# EasyEDA Pro project ProDoc_TP_V2.10_BG.epro

# Schematic Schematic_210_BG

## Sheets
1 MCU: Board Name: TP_V2.8_BG_1; Create Date: 2024-10-07; Page Name: MCU; Project Name: gavvv; Schematic Name: Schematic_28_BG_1; Update Date: 2024-10-07; Company: 嘉立创EDA; Page Size: A4; Version: V1.0
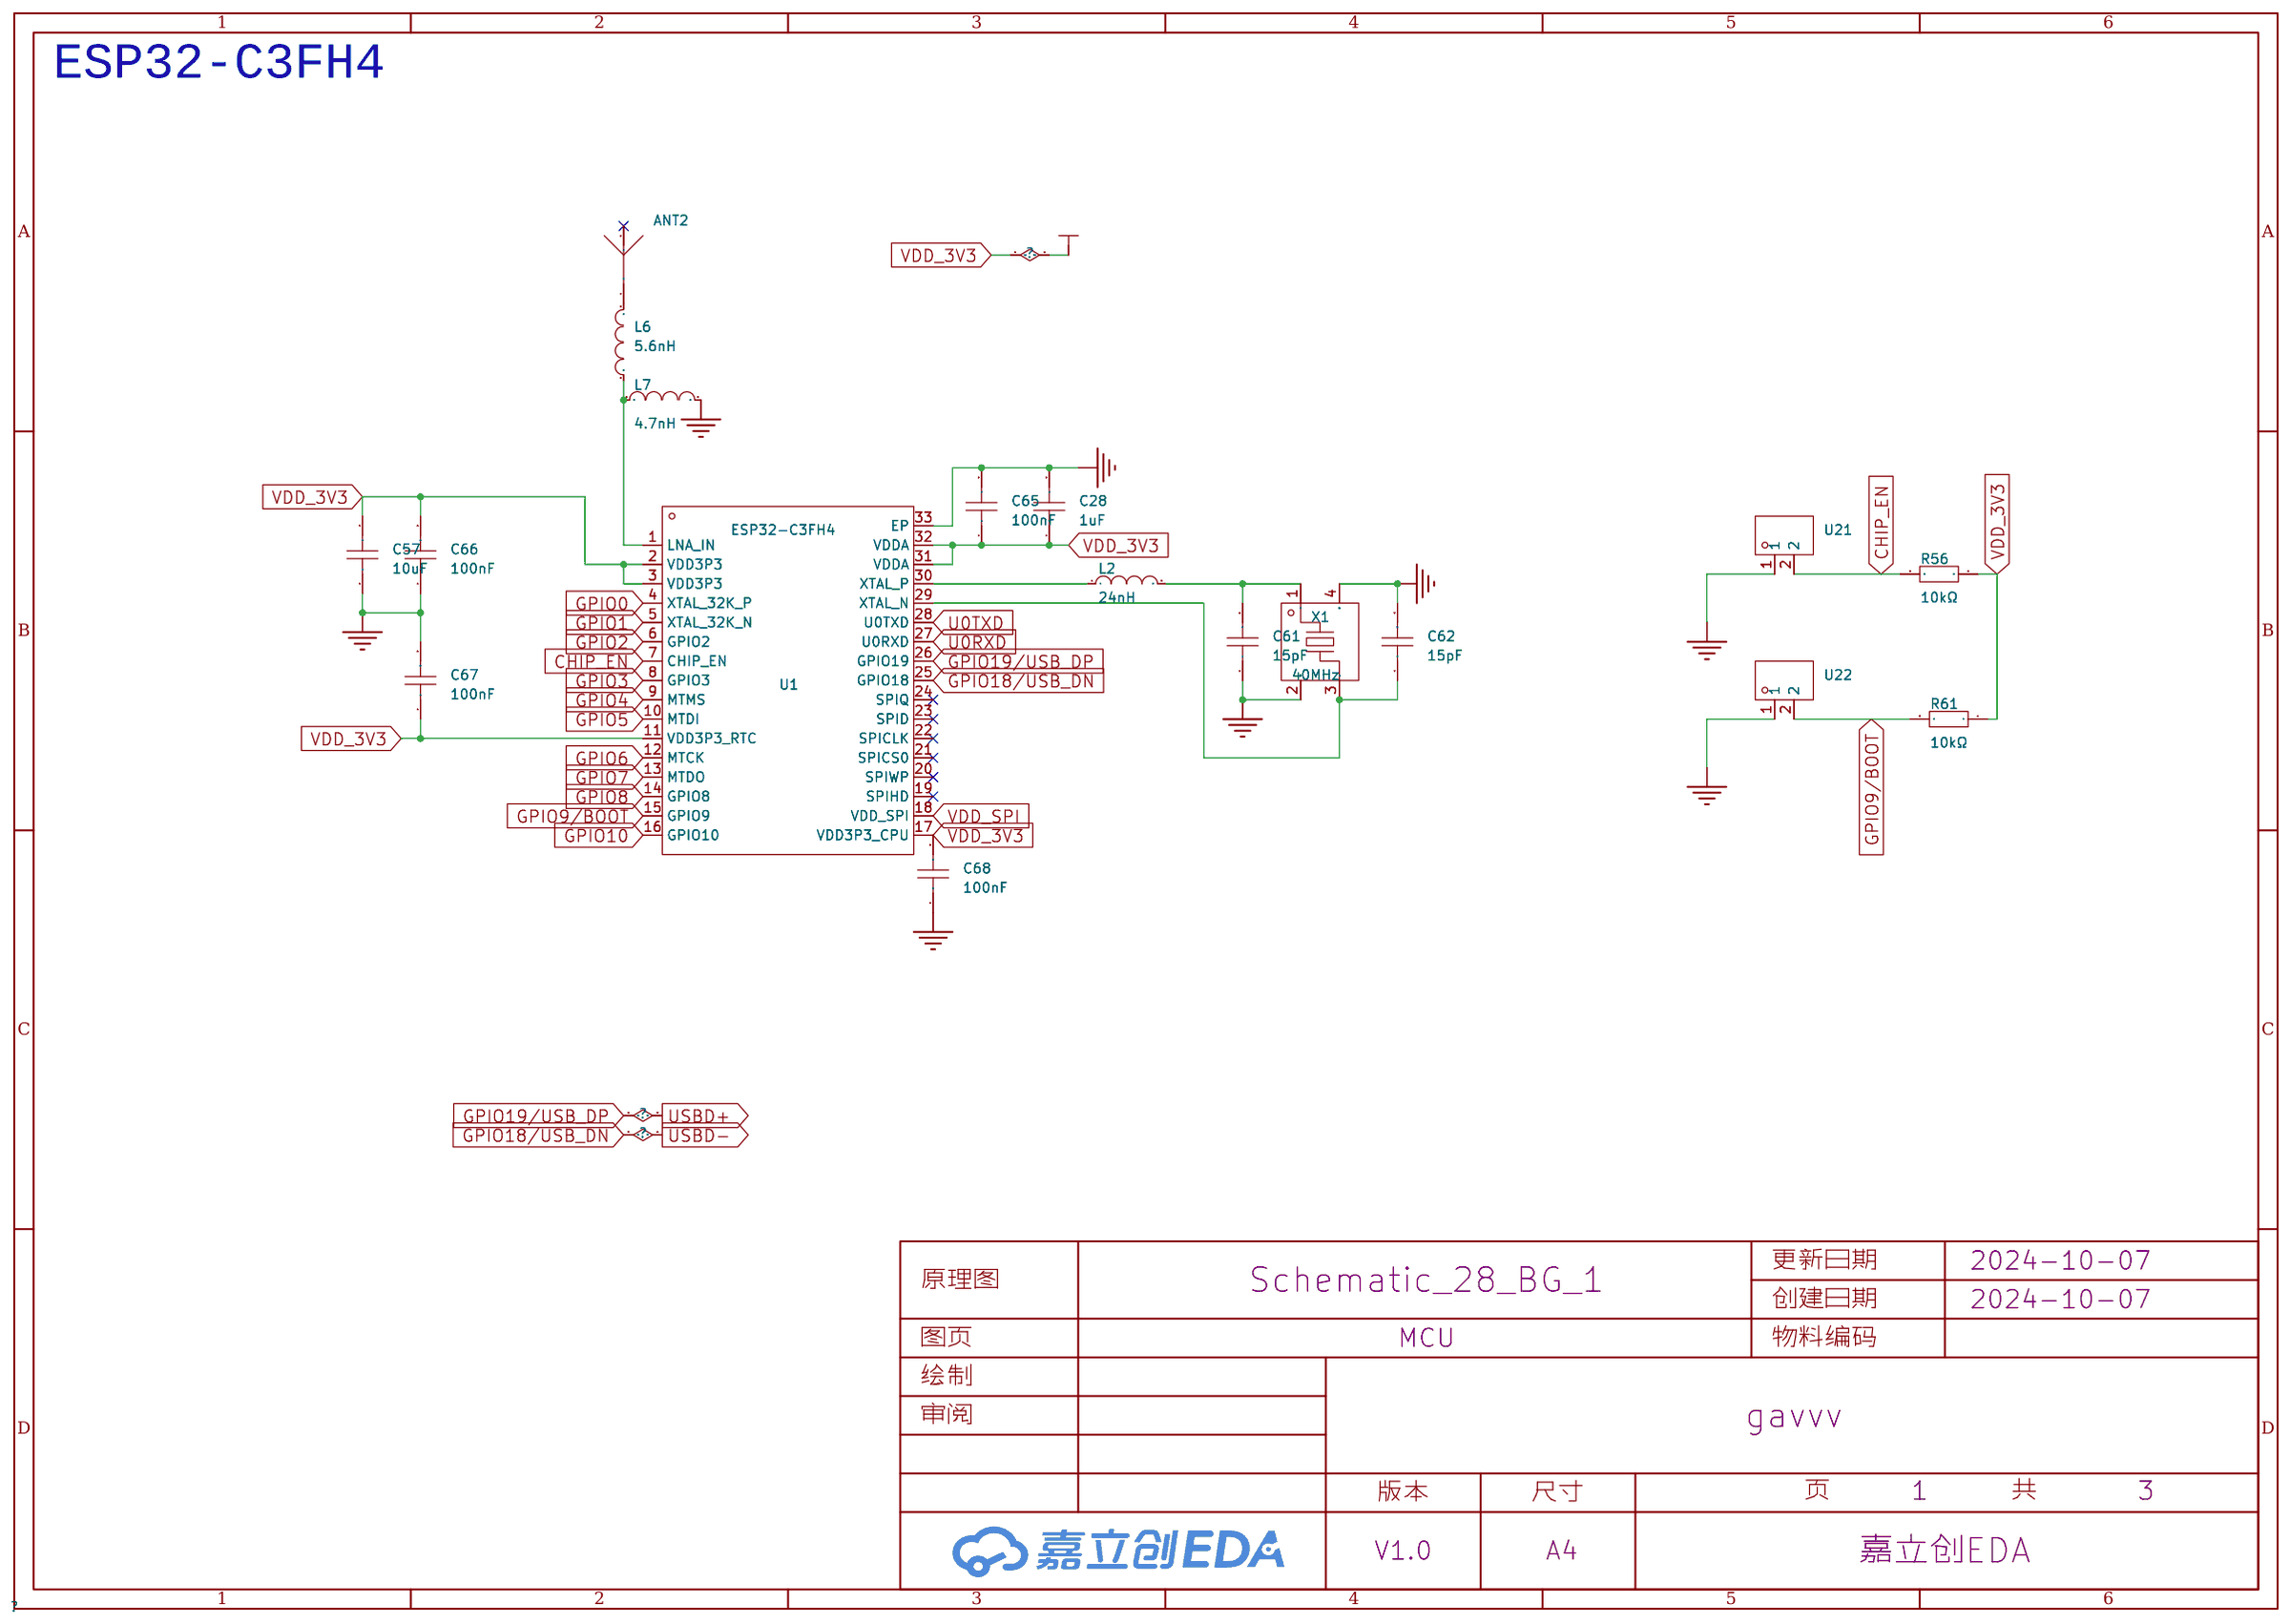
[diagram p0: MCU]
2 PWR: Page Name: PWR
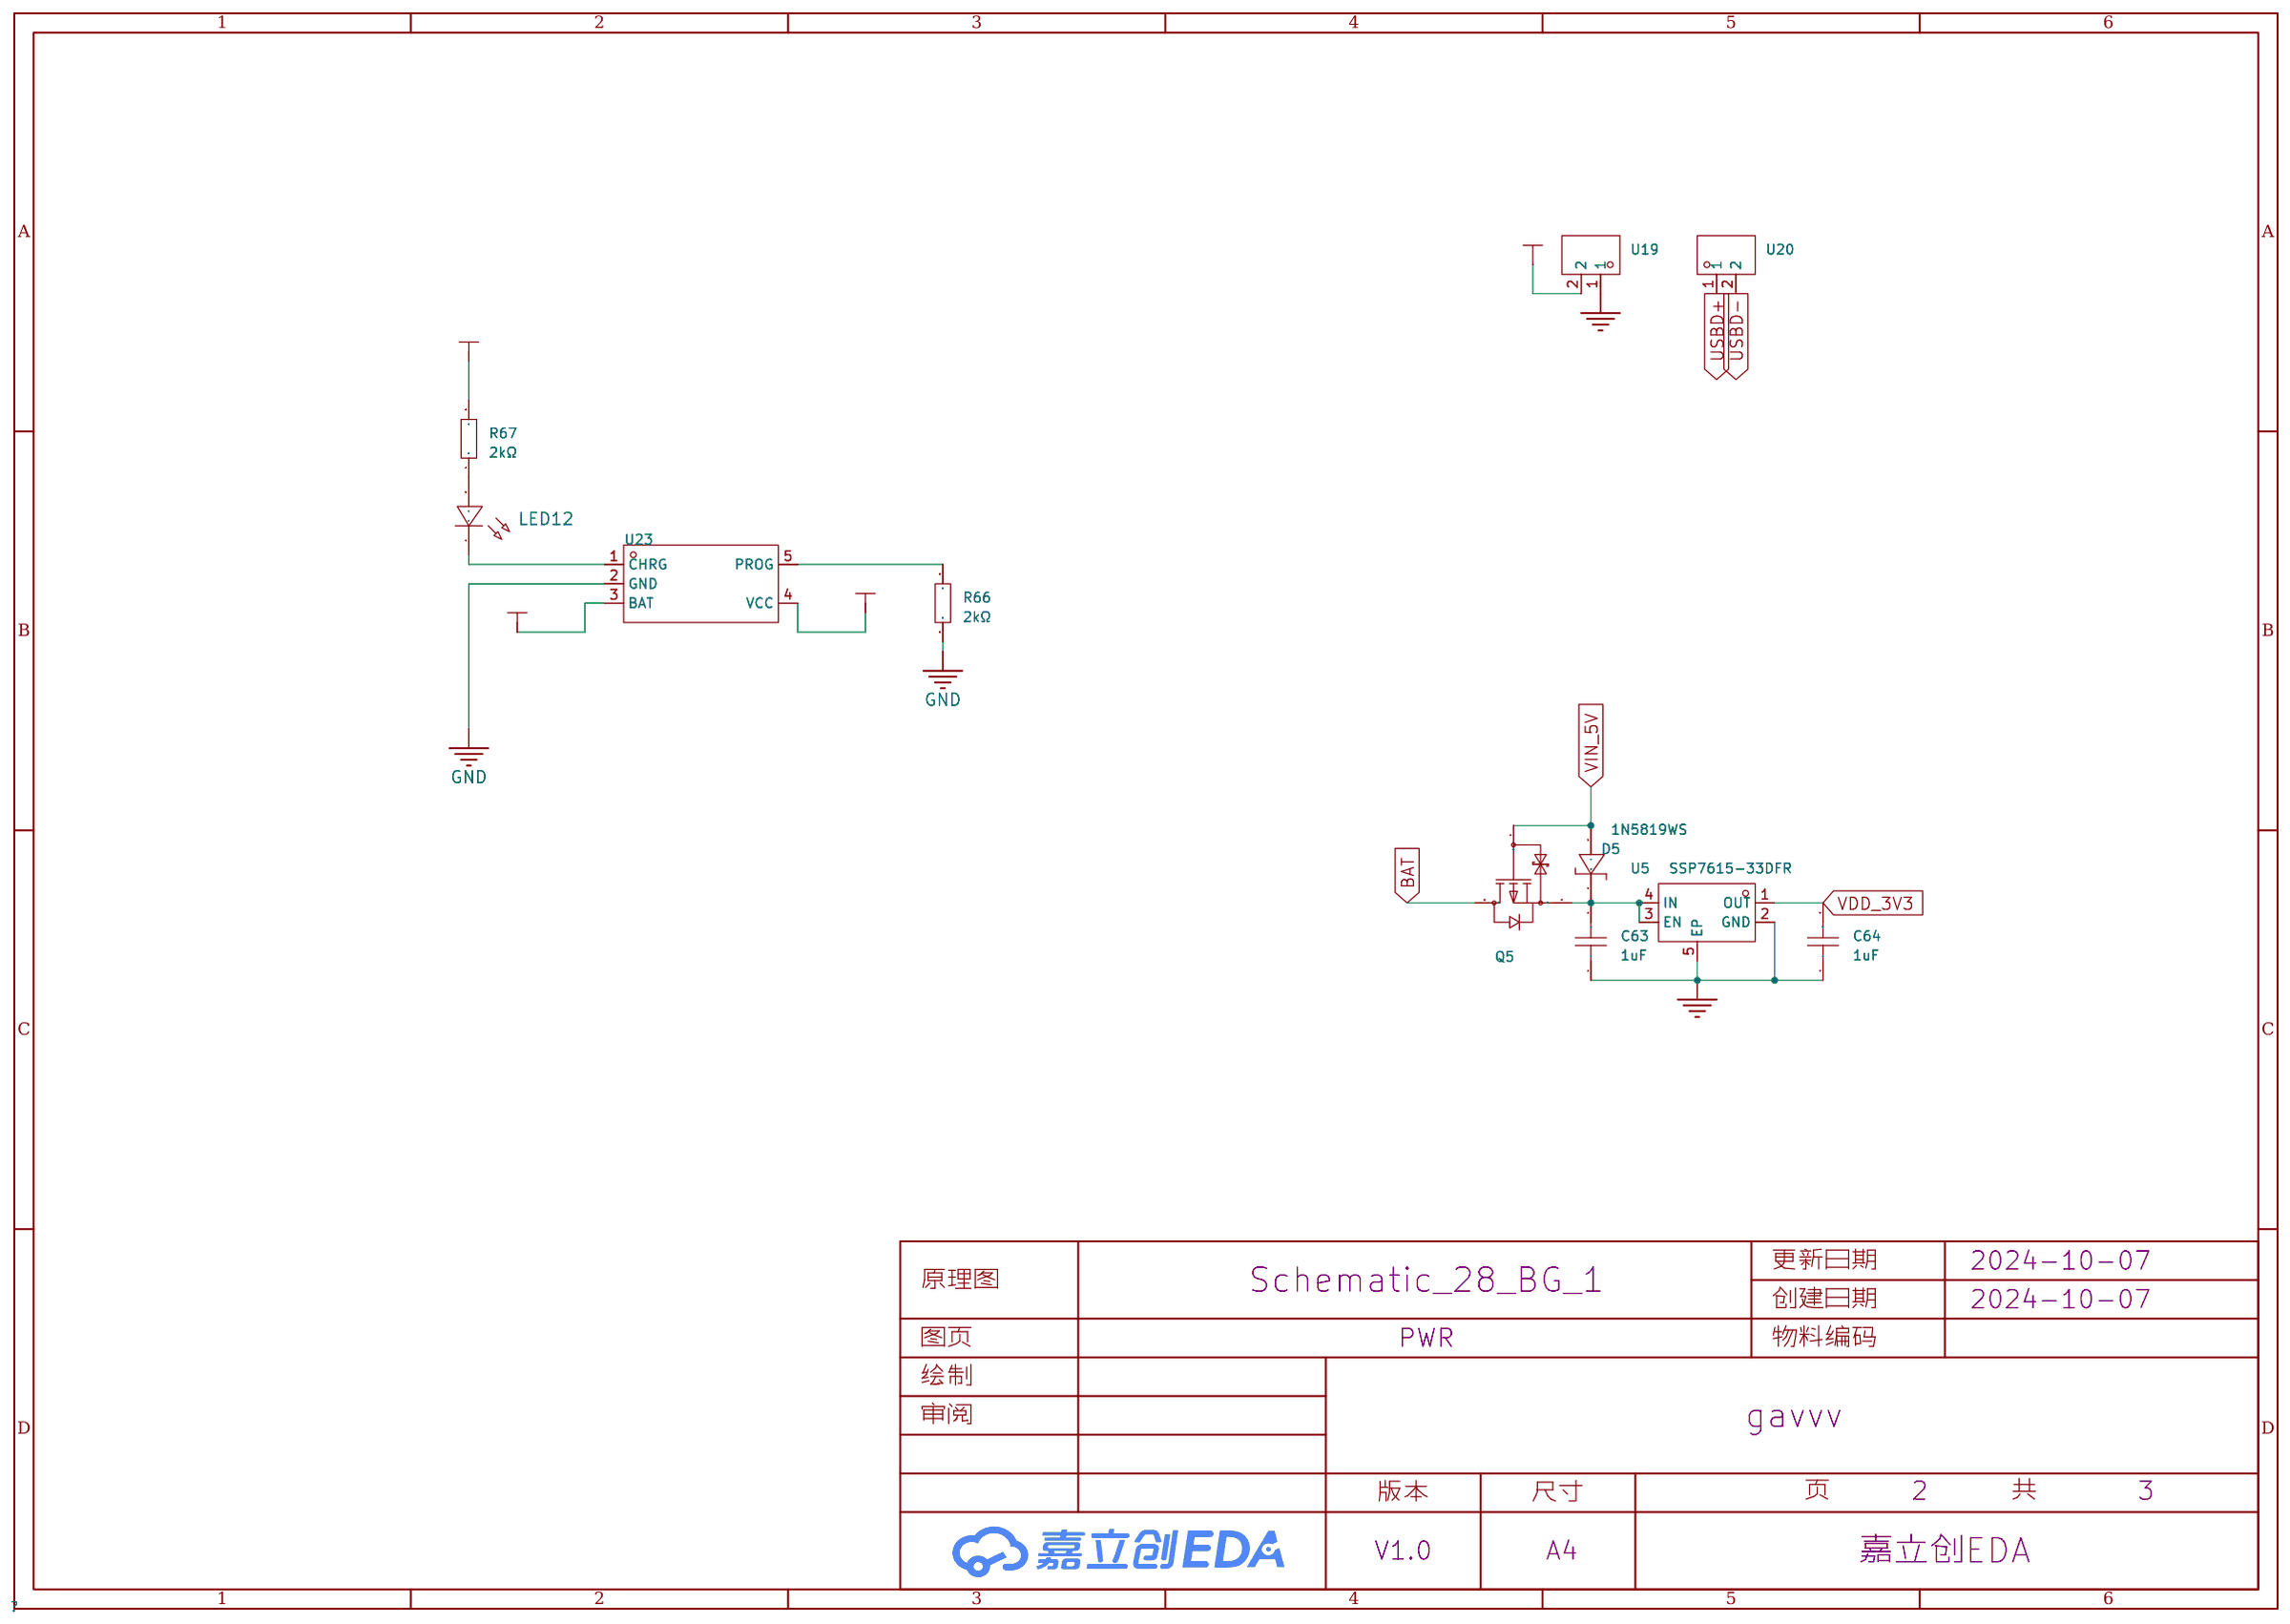
[diagram p1: PWR]
3 USER: Board Name: TP_V2.10_BG; Create Date: 2024-10-11; Page Name: USER; Schematic Name: Schematic_210_BG; Update Date: 2024-10-11
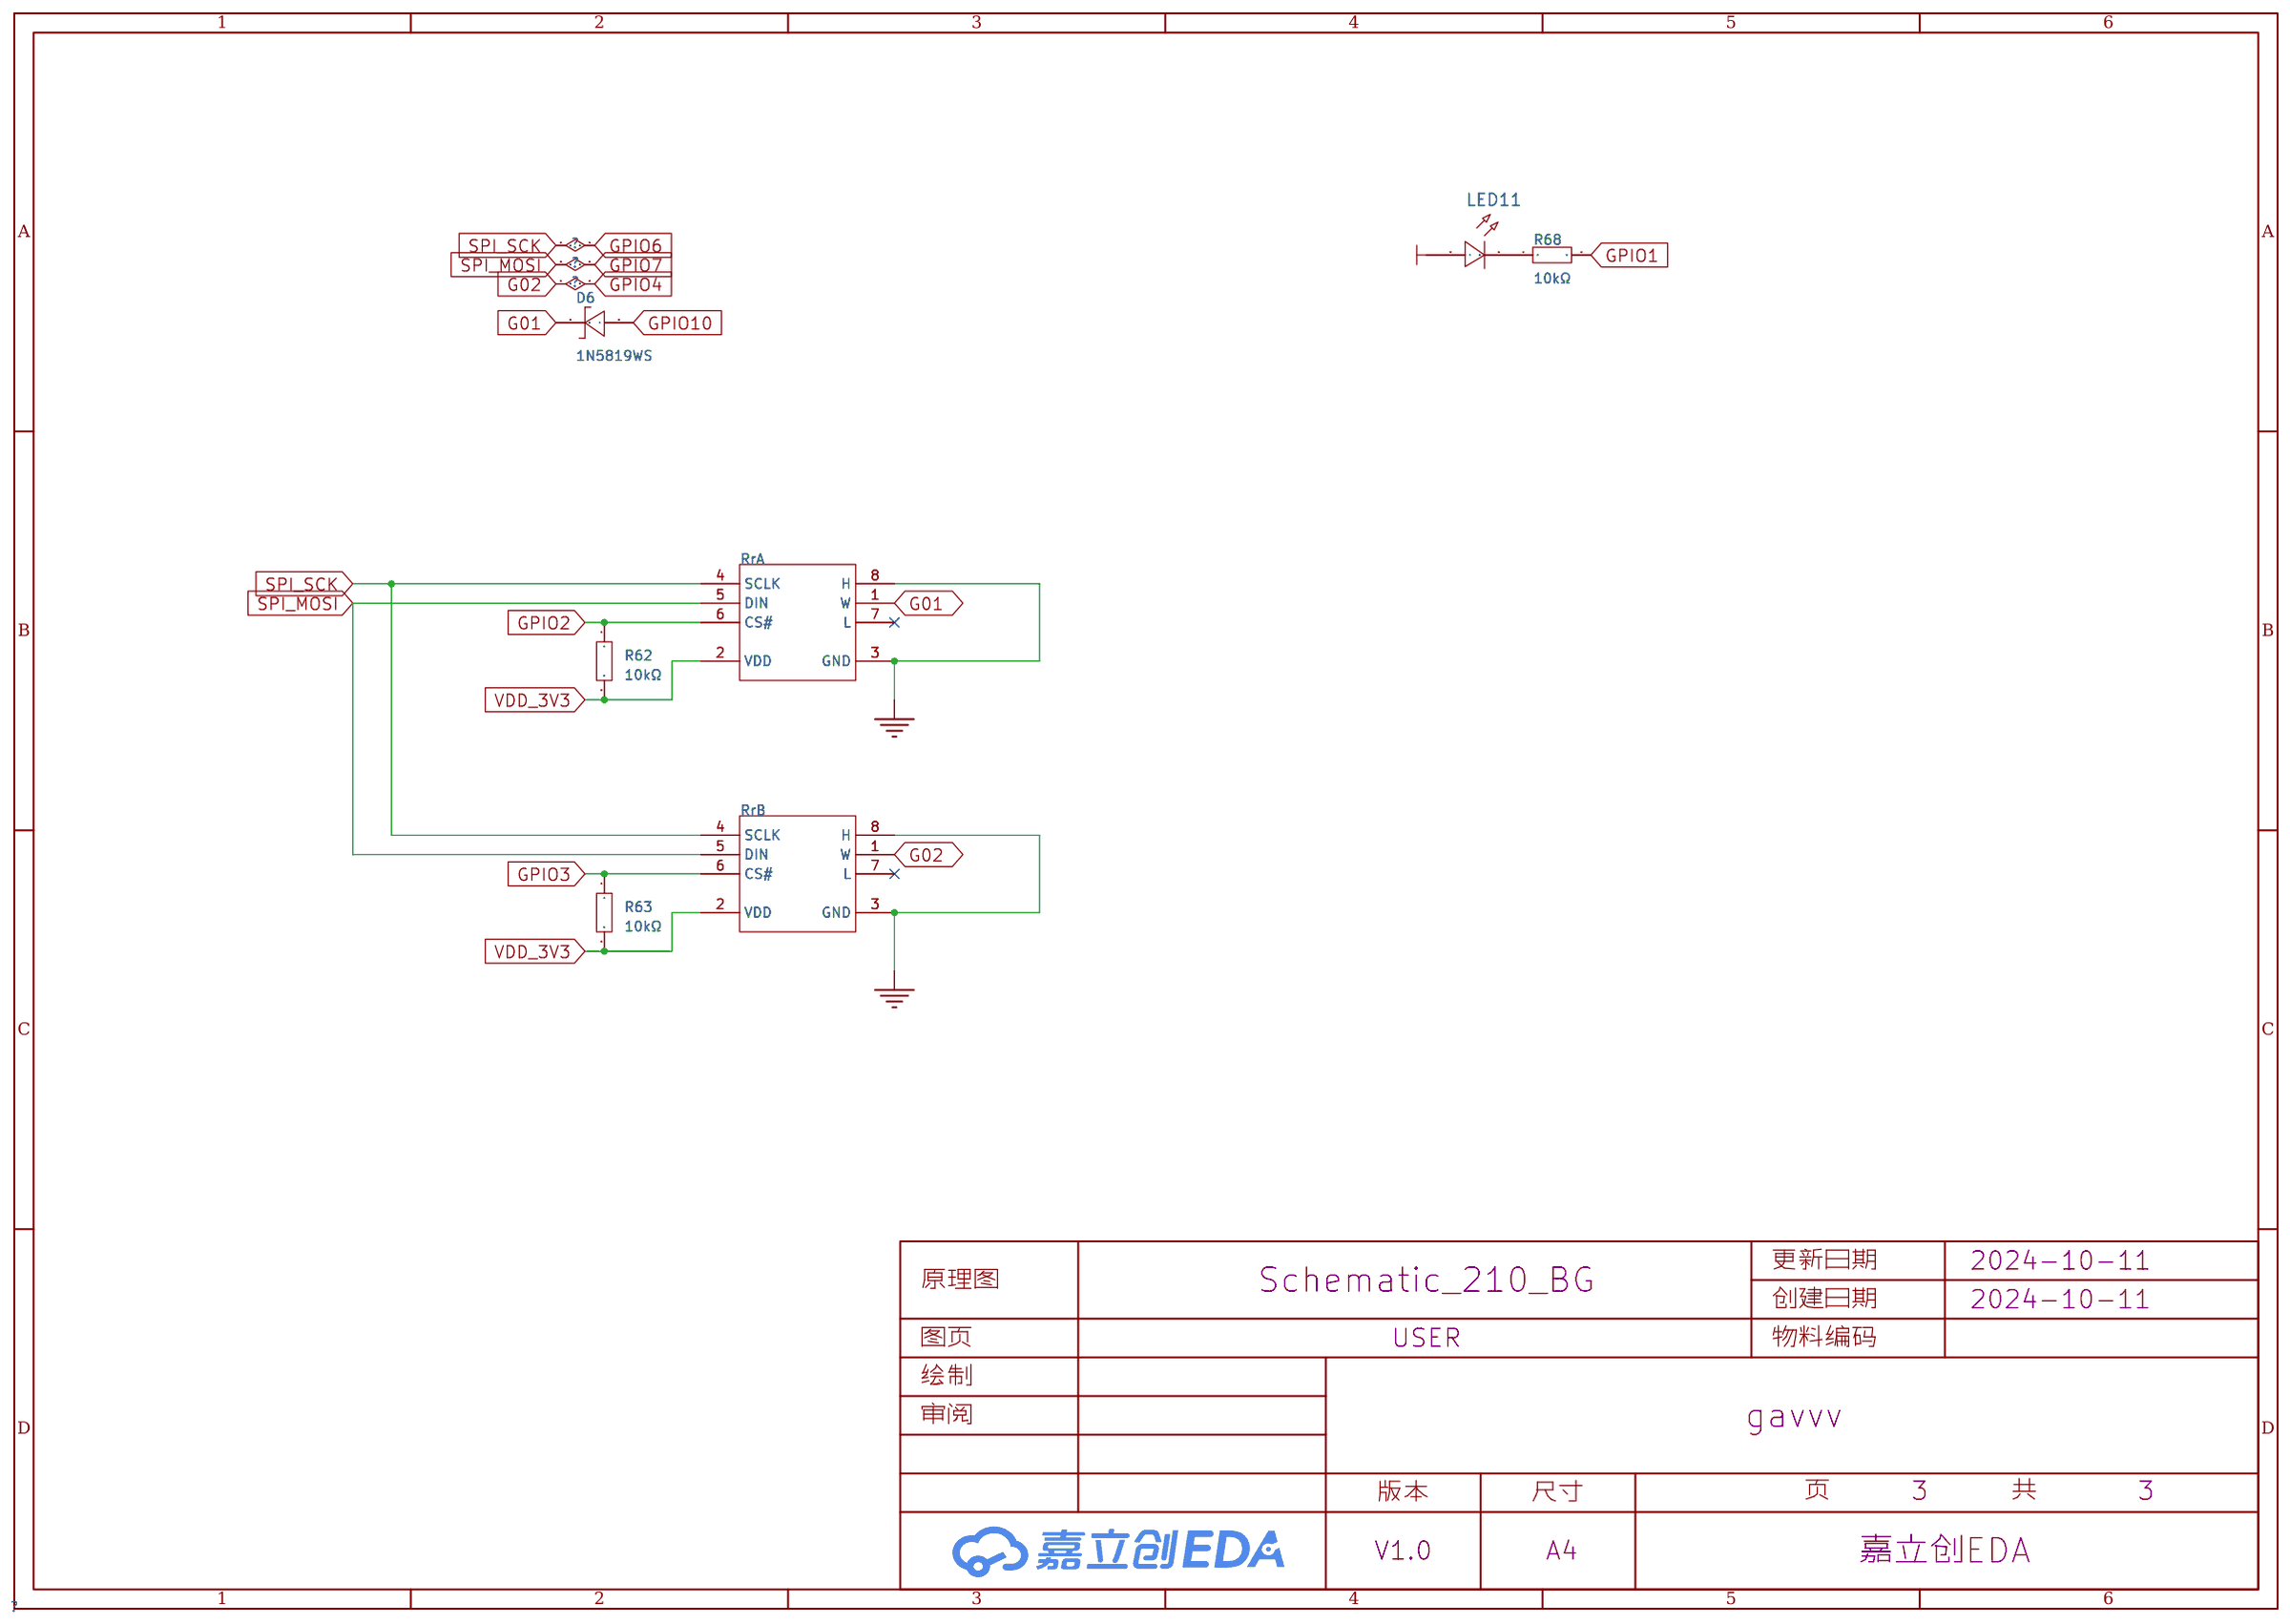
[diagram p2: USER]

## Parts
sheet MCU
ANT2  -  [ANT-SMD_L3.2-W1.6_CA-C01]
C28  1uF  [C0402]
C57  10uF  [C0402]
C61  15pF  [C0402]
C62  15pF  [C0402]
C65  100nF  [C0402]
C66  100nF  [C0402]
C67  100nF  [C0402]
C68  100nF  [C0402]
L2  24nH  [IND-SMD_L1.0-W0.5-2]
L6  5.6nH  [IND-SMD_L1.0-W0.5-2]
L7  4.7nH  [IND-SMD_L1.0-W0.6]
R56  10kΩ  [R0402]
R61  10kΩ  [R0402]
U1  ESP32-C3FH4  [QFN-32_L5.0-W5.0-P0.50-TL-EP3.7]
U21  HX PZ1.0-1x2P ZZ  [HDR-TH_2P-P1.00-V-M]
U22  HX PZ1.0-1x2P ZZ  [HDR-TH_2P-P1.00-V-M]
X1  40MHz  [CRYSTAL-SMD_4P-L2.0-W1.6-BL_ECS_ECS-240-8-37]
sheet PWR
C63  1uF  [C0402]
C64  1uF  [C0402]
D5  1N5819WS  [sod-323_l1.8-w1.3-ls2.5-rd]
LED12  LED0402-红色  [LED0402-RD_RED]
Q5  CJE3139K  [SC-75-3_L1.6-W0.8-P1.00-LS1.7-BR]
R66  2kΩ  [R0402]
R67  2kΩ  [R0402]
U5  SSP7615-33DFR  [XDFN-4_L1.0-W1.0-P0.65-BL-EP]
U19  X1311WV-02J-C40D24  [HDR-TH_2P-P1.27-V-M]
U20  X1311WV-02J-C40D24  [HDR-TH_2P-P1.27-V-M]
U23  TP4054  [SOT-23-5_L2.9-W1.6-P0.95-LS2.8-BR]
sheet USER
D6  1N5819WS  [sod-323_l1.8-w1.3-ls2.5-rd]
LED11  LED0402-红色  [LED0402-RD_RED]
R62  10kΩ  [R0402]
R63  10kΩ  [R0402]
R68  10kΩ  [R0402]
RrA  TPL0501-100DCNR  [SOT-23-8_L3.0-W1.7-P0.65-LS2.8-BL]
RrB  TPL0501-100DCNR  [SOT-23-8_L3.0-W1.7-P0.65-LS2.8-BL]

## Library data of the parts
ANT2 = CA-C01: Supplier Part: C9900018999; Supplier Footprint: SMD_3.2x1.6x0.4mm; JLCPCB Part Class: ExtendedPart; Datasheet: https://atta.szlcsc.comnull; Supplier: LCSC
C28 C57 C61-C68 = CL05B104KB54PNC: 容值:100nF;精度:±10%;额定电压:50V;材质(温度系数):X7R;; LCSC Part Name: 100nF ±10% 50V; Supplier Part: C307331; Manufacturer: SAMSUNG(三星); Supplier Footprint: 0402; JLCPCB Part Class: 基础库; Datasheet: https://atta.szlcsc.com/upload/public/pdf/source/20181009/C307331_222F7C870FD3EA5F46F538B483443886.pdf; Supplier: LCSC; Tolerance: ±10%; Voltage Rated: 50V; Temperature Coefficient: X7R
L2 = LQW15AN24NG80D: 电感值:24nH;精度:±2%;额定电流:770mA;饱和电流(Isat):-;; LCSC Part Name: 24nH ±2%; Supplier Part: C668462; Manufacturer: muRata(村田); Supplier Footprint: 0402; JLCPCB Part Class: 扩展库; Datasheet: https://atta.szlcsc.com/upload/public/pdf/source/20201228/C668462_EF8FB8FB445A38E861DA03D3842BC057.pdf; Supplier: LCSC; Tolerance: ±2%; Rated Current: 770mA; DC Resistance (DCR): 212mΩ
L6 = LQW15AN5N6C10D: 电感值:5.6nH;额定电流:800mA;饱和电流(Isat):-;; Supplier Part: C91626; Manufacturer: muRata(村田); Supplier Footprint: 0402; JLCPCB Part Class: 扩展库; Datasheet: https://atta.szlcsc.com/upload/public/pdf/source/20161226/1482720179870.pdf; Supplier: LCSC; Rated Current: 800mA; DC Resistance (DCR): 51mΩ
L7 = LQW15AN4N7B00D: 电感值:4.7nH;额定电流:750mA;饱和电流(Isat):-;; Supplier Part: C98064; Manufacturer: muRata(村田); Supplier Footprint: 0402; JLCPCB Part Class: 扩展库; Datasheet: https://atta.szlcsc.com/upload/public/pdf/source/20191016/C437364_463D6516B3BAE72B1DA0754F3D9B8308.pdf; Supplier: LCSC; Rated Current: 750mA; DC Resistance (DCR): 70mΩ
R56 R61-R63 R68 = 0402WGF1002TCE: 阻值:10kΩ;精度:±1%;功率:62.5mW;温度系数:±100ppm/℃;电阻类型:厚膜电阻;; LCSC Part Name: 10kΩ ±1% 62.5mW 厚膜电阻; Supplier Part: C25744; Manufacturer: UNI-ROYAL(厚声); Supplier Footprint: 0402; JLCPCB Part Class: Basic Part; Datasheet: https://atta.szlcsc.com/upload/public/pdf/source/20200306/C422600_1E6D84923E4A46A82E41ADD87F860B5C.pdf; Supplier: LCSC; Tolerance: ±1%; Power(Watts): 62.5mW; Overload Voltage (Max): 50V; Temperature Coefficient: ±100ppm/℃; Type: 厚膜电阻; Operating Temperature Range: -55℃~+155℃
U1 = ESP32-C3FH4: Supplier Part: C2858491; Manufacturer: ESPRESSIF(乐鑫); Supplier Footprint: QFN-32; JLCPCB Part Class: Extended Part; Datasheet: https://atta.szlcsc.com/upload/public/pdf/source/20210726/B8823F05EB5B1ECA99D4F01661A43FA8.pdf; Supplier: LCSC
U21 U22 = HX PZ1.0-1x2P ZZ: 插针结构:1x2P;间距:1mm;圆针/方针:方针;安装类型:直插;排数:单排;总PIN位数:2P;额定电流:750mA;配合针长度:2mm;塑高:1mm;端接针长度:2mm;触头材质:磷青铜;触头镀层:金;工作温度范围:-40℃~+105℃;焊接温度(最大值):260℃;颜色:黑色;; LCSC Part Name: 1x2P 间距:1mm 方针 直插; Supplier Part: C22438170; Manufacturer: hanxia(韩下); Supplier Footprint: 插件,P=1mm; JLCPCB Part Class: 扩展库; Datasheet: https://atta.szlcsc.com/upload/public/pdf/source/20240522/59E077311630E4900351916CE6BE2E74.pdf; Supplier: LCSC; Pin Structure: 1x2P; Pitch: 1mm; Circluar Pins/Square Pins: 方针; Mounting Type: 直插; Number of Rows: 单排; Number of Pins: 2P; Current Rating (Max): 750mA; Length of Mating Pin: 2mm; Insulation Height: 1mm; Length of End Connection Pin: 2mm; Contact Material: 磷青铜; Contact Plating: 金; Operating Temperature Range: -40℃~+105℃; Soldering Temperature(Max): 260℃; Color: 黑色
X1 = 7D040000I01: 频率:40MHz;频率公差:±10ppm;频率稳定度:±20ppm;负载电容:10pF;; LCSC Part Name: 40MHz ±10ppm 内置负载电容:10pF; Supplier Part: C648973; Manufacturer: HD(浩都频率); Supplier Footprint: SMD2016-4P; JLCPCB Part Class: 扩展库; Datasheet: https://atta.szlcsc.com/upload/public/pdf/source/20220223/118C2648083ADD7FA58C5549E27EC941.pdf; Supplier: LCSC; Crystal Type: 贴片无源晶振; Frequency Tolerance: ±10ppm; Frequency Stability: ±20ppm; Load Capacitance: 10pF
D5 D6 = 1N5819WS_C191023: 直流反向耐压(Vr):40V;平均整流电流(Io):1A;正向压降(Vf):600mV@1A;; LCSC Part Name: 40V 1A 600mV@1A; Supplier Part: C191023; Manufacturer: Hottech(合科泰); Supplier Footprint: SOD-323; JLCPCB Part Class: Basic Part; Datasheet: https://atta.szlcsc.com/upload/public/pdf/source/20180614/C191023_3C6A6398B911F3A4C23E7538EE054643.pdf; Supplier: LCSC; Reverse Voltage (Vr): 40V; Average Rectified Current (Io): 1A; Forward Voltage (Vf@If): 600mV@1A
LED11 LED12 = LED0402-红色: Supplier Part: C9900023317; Supplier Footprint: LED_0402_RED; JLCPCB Part Class: ExtendedPart; Datasheet: https://atta.szlcsc.comnull; Supplier: LCSC
Q5 = CJE3139K: 类型:P沟道;漏源电压(Vdss):20V;连续漏极电流(Id):660mA;功率(Pd):150mW;导通电阻(RDS(on)@Vgs,Id):520mΩ@4.5V,1A;阈值电压(Vgs(th)@Id):1.1V@250μA;; LCSC Part Name: P沟道20V660mA; Supplier Part: C70991; Manufacturer: CJ（江苏长电/长晶）; Supplier Footprint: SC-75(SOT-523); JLCPCB Part Class: ExtendedPart; Datasheet: https://atta.szlcsc.com/upload/public/pdf/source/20160416/1460799392748.pdf; Supplier: LCSC; Type: P沟道; Drain Source Voltage (Vdss): 20V; Continuous Drain Current (Id): 660mA; Power Dissipation (Pd): 150mW; Drain Source On Resistance (RDS(on)@Vgs,Id): 520mΩ@4.5V,1A; Gate Threshold Voltage (Vgs(th)@Id): 1.1V@250μA
R66 R67 = 0402WGF2001TCE: 电阻类型:厚膜电阻;阻值:2kΩ;精度:±1%;功率:62.5mW;; LCSC Part Name: 2kΩ±1%62.5mW; Supplier Part: C4109; Manufacturer: UNI-ROYAL(厚声); Supplier Footprint: 0402; JLCPCB Part Class: BasicPart; Datasheet: https://atta.szlcsc.com/upload/public/pdf/source/20200306/C422600_1E6D84923E4A46A82E41ADD87F860B5C.pdf; Supplier: LCSC; Type: 厚膜电阻; Tolerance: ±1%; Power(Watts): 62.5mW; Temperature Coefficient: ±100ppm/℃; Overload Voltage (Max): 50V; Operating Temperature Range: -55℃~+155℃
U5 = RS3236-3.3YUTDN4: Supplier Part: C3011523; Manufacturer: Siproin(上海矽朋); Supplier Footprint: XDFN-4-EP(1x1); JLCPCB Part Class: 扩展库; Datasheet: https://atta.szlcsc.com/upload/public/pdf/source/20220509/B9D9A652E556F610A8A04F6615DB432C.pdf; Supplier: LCSC; Output Type: 固定; Output Polarity: 正; Number of Outputs: 1; Maximum Input Voltage: 8V; Output Voltage: 3.3V; Dropout Voltage: 200mV@(100mA); Output Current: 400mA; Power Supply Rejection Ratio (PSRR): 60dB@(1kHz)
U19 U20 = X1311WV-02J-C40D24: 插针结构:1x2P;间距:1.27mm;行距:1.27mm;圆针/方针:方针;安装类型:-;排数:单排;总PIN位数:2P;额定电流:3A;额定电压:250V;配合针长度:-;塑高:1mm;端接针长度:-;触头材质:黄铜;触头镀层:金;工作温度范围:-40℃~+105℃;焊接温度(最大值):260℃;颜色:黑色;; LCSC Part Name: 1x2P 间距:1.27mm 方针; Supplier Part: C5243682; Manufacturer: XKB Connection(中国星坤); Supplier Footprint: 插件,P=1.27mm; JLCPCB Part Class: Extended Part; Datasheet: https://atta.szlcsc.com/upload/public/pdf/source/20221103/F707F495E439008E8A05CA9A3D33D9E0.pdf; Supplier: LCSC; Pin Structure: 1x2P; Pitch: 1.27mm; Row Spacing: 1.27mm; Circluar Pins/Square Pins: 方针; Number of Rows: 单排; Number of Pins: 2P; Current Rating (Max): 3A; Voltage Rating (Max): 250V; Insulation Height: 1mm; Contact Material: 黄铜; Contact Plating: 金; Operating Temperature Range: -40℃~+105℃; Soldering Temperature(Max): 260℃; Color: 黑色
U23 = TP4054_C5381776: 电源电压:4V~9V;最大充电电流:800mA;电池类型:锂离子/聚合物;电池节数:1;; Supplier Part: C5381776; Manufacturer: JSMSEMI(杰盛微); Supplier Footprint: SOT-23-5; JLCPCB Part Class: 扩展库; Datasheet: https://atta.szlcsc.com/upload/public/pdf/source/20240105/B23E77B3239CBD8CB006536E3C384378.pdf; Supplier: LCSC; The Chip Type: 电池管理; Supply Voltage: 4V~9V; Maximum Charge Current: 800mA; Type of Battery: 锂离子/聚合物; Number of Cells: 1; Operating Temperature: -40℃~+85℃
RrA RrB = TPL0501-100DCNR: 电阻值(欧姆):100kΩ;接口类型:SPI;供电电压:2.7V~5.5V;精度:±20%;; Supplier Part: C131323; Manufacturer: TI(德州仪器); Supplier Footprint: SOT-23-8; JLCPCB Part Class: 扩展库; Datasheet: https://www.ti.com/cn/lit/gpn/tpl0501-100; Supplier: LCSC; Resistance Value (Ohms): 100kΩ; Number of Taps: 256; Interface Type: SPI; Number of Channels: 1; Supply Voltage: 2.7V~5.5V; Precision: ±20%; Temperature Coefficient (Typ): 35ppm/℃; Operating Temperature: -40℃~+125℃

## Nets
3V3: C28.1 C57.2 C64.2 C65.1 C66.2 C67.1 C68.2 LED11.2(A) R56.1 R61.1 R62.2 R63.2 RrA.2(VDD) RrB.2(VDD) U1.2(VDD3P3) U1.3(VDD3P3) U1.11(VDD3P3_RTC) U1.17(VDD3P3_CPU) U1.31(VDDA) U1.32(VDDA) U5.1(OUT)
GND: C28.2 C57.1 C61.1 C62.2 C63.1 C64.1 C65.2 C66.1 C67.2 C68.1 L7.2 R66.1 RrA.3(GND) RrA.8(H) RrB.3(GND) RrB.8(H) U1.33(EP) U5.2(GND) U5.5(EP) U19.1 U21.1 U22.1 U23.2(GND) X1.2(GND) X1.4(GND)
VDD_SPI: U1.18(VDD_SPI)
VIN_5V: D5.2(A) Q5.1(G) R67.2 U19.2 U23.4(VCC)
BAT: Q5.3(D) U23.3(BAT)
CHIP_EN: R56.2 U1.7(CHIP_EN) U21.2
G01: D6.1(C) RrA.1(W)
G02: RrB.1(W) U1.9(MTMS)
GPIO0: U1.4(XTAL_32K_P)
GPIO1: R68.2 U1.5(XTAL_32K_N)
GPIO2: R62.1 RrA.6(CS#) U1.6(GPIO2)
GPIO3: R63.1 RrB.6(CS#) U1.8(GPIO3)
GPIO5: U1.10(MTDI)
GPIO6: RrA.4(SCLK) RrB.4(SCLK) U1.12(MTCK)
GPIO7: RrA.5(DIN) RrB.5(DIN) U1.13(MTDO)
GPIO8: U1.14(GPIO8)
GPIO9/BOOT: R61.2 U1.15(GPIO9) U22.2
GPIO10: D6.2(A) U1.16(GPIO10)
GPIO18/USB_DN: U1.25(GPIO18) U20.2
GPIO19/USB_DP: U1.26(GPIO19) U20.1
U0RXD: U1.27(U0RXD)
U0TXD: U1.28(U0TXD)
$1N7726: C61.2 L2.2 X1.1
$1N7727: L2.1 U1.30(XTAL_P)
$1N7730: C62.1 U1.29(XTAL_N) X1.3
$1N7731: L6.1 L7.1 U1.1(LNA_IN)
$1N8200: ANT2.1(ANT) L6.2
$2N2933: R66.2 U23.5(PROG)
$2N3051: LED12.1(C) U23.1(CHRG)
$2N3155: LED12.2(A) R67.1
$2N4196: C63.2 D5.1(C) Q5.2(S) U5.3(EN) U5.4(IN)
$3N7952: LED11.1(C) R68.1

Not connected (* = marked no-connect by the designer): ANT2 2*; RrA 7(L)*; RrB 7(L)*; U1 19(SPIHD)* 20(SPIWP)* 21(SPICS0)* 22(SPICLK)* 23(SPID)* 24(SPIQ)*

## Notes on the sheets
sheet 1
- ESP32-C3FH4

# Board Gochizo_V2.10_BG
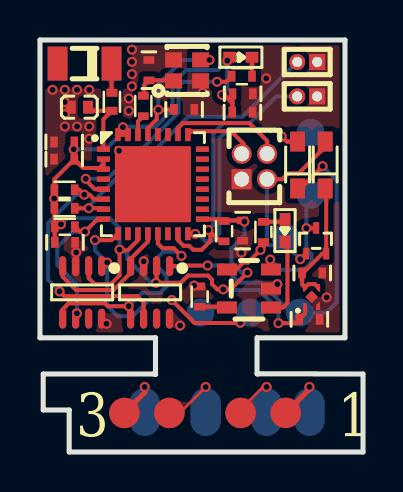
[diagram p3: board, top side]
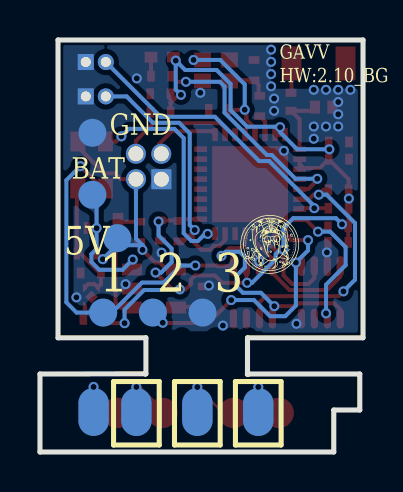
[diagram p4: board, bottom side, seen from below]

Outline 16.16 x 20.6 mm; copper layers: Top Layer, Bottom Layer. Coordinates in mm from the lower left corner of the outline.
Outline path: 5.79,3.88 5.74,3.93 5.71,3.9 0.16,3.9 0.16,2.1 1.46,2.1 1.46,0 16.16,0 16.16,3.9 10.87,3.91 10.89,3.89 ; 5.78,3.89 5.78,5.71 0,5.71 0,20.6 15.26,20.6 15.26,5.71 10.86,5.71 10.86,3.91
Stack: Top Layer 0.035mm / Dielectric1 1.51mm FR4 er 4.5 / Bottom Layer 0.035mm

## Design rules (mm)
template: 自定义配置
spacing copperThickness1oz (default): track to track 0.102, other pairs 0 to 0.3
spacing copperThickness2oz: track to track 0.203, other pairs 0.152 to 0.3
track width copperThickness1oz (default): min 0.127, default 0.254, max 2.54
track width copperThickness2oz: min 0.203, default 0.254, max 2.54
differential pair differentialPair (default): width min 0.127, default 0.254, max 2.54; gap min 0.152, default 0.152
via viaSize (default): diameter min 0.5, default 0.61, max 10; hole min 0.3, default 0.305, max 6.3

## Placement (name value [footprint] x y rotation side)
ANT2  -  [ANT-SMD_L3.2-W1.6_CA-C01]  2.23 19.42 180 top
C28  1uF  [C0402]  10.13 16.99 0 top
C57  10uF  [C0402]  1.21 15.5 0 top
C61  15pF  [C0402]  5.45 19.09 270 top
C62  15pF  [C0402]  7.21 17.13 0 top
C63  1uF  [C0402]  13.62 8.95 180 top
C64  1uF  [C0402]  13.48 6.63 180 top
C65  100nF  [C0402]  10.14 17.91 0 top
C66  100nF  [C0402]  1.21 14.64 0 top
C67  100nF  [C0402]  1.25 10.48 0 top
C68  100nF  [C0402]  10.14 11.07 90 top
D5  1N5819WS  [sod-323_l1.8-w1.3-ls2.5-rd]  14.27 14.35 90 top
D6  1N5819WS  [sod-323_l1.8-w1.3-ls2.5-rd]  12.89 14.35 90 top
L2  24nH  [IND-SMD_L1.0-W0.5-2#2]  5.17 17.3 90 top
L6  5.6nH  [IND-SMD_L1.0-W0.5-2]  3.6 17.51 90 top
L7  4.7nH  [IND-SMD_L1.0-W0.6]  1.97 17.24 180 top
LED11  LED0402-红色  [LED0402-RD_RED]  10.05 19.74 180 top
LED12  LED0402-红色  [LED0402-RD_RED]  12.26 11.07 90 top
NOREF  -  [Pad_e1020]  12.29 1.95 180 top
NOREF#2  -  [Pad_e2905]  12.3 10.69 180 top
NOREF#3  -  [Pad_e962]  10.52 6.97 180 top
NOREF#4  -  [Pad_e2874]  13.54 12.86 270 top
NOREF#5  -  [Pad_e1008]  5.24 2 180 top
NOREF#6  -  [Pad_e1019]  10.04 1.95 180 top
NOREF#7  -  [Pad_e1017]  4.22 1.95 180 top
NOREF#8  -  [Pad_e994]  8.03 6.97 180 top
NOREF#9  -  [Pad_e1018]  6.47 1.95 180 top
NOREF#10  -  [Pad_e1016]  13.48 2 180 top
NOREF#11  -  [Pad_e2875]  13.54 15.96 270 top
NOREF#12  -  [Pad_e1009]  8.29 2 180 top
NOREF#13  -  [Pad_e952]  13 6.97 180 top
NOREF#14  -  [Pad_e1015]  11.34 2 180 top
Q5  CJE3139K  [SC-75-3_L1.6-W0.8-P1.00-LS1.7-BR]  13.82 10.56 270 top
R56  10kΩ  [R0402]  1.23 12.19 0 top
R61  10kΩ  [R0402]  9.21 11.04 270 top
R62  10kΩ  [R0402]  1.23 13.11 180 top
R63  10kΩ  [R0402]  1.24 11.26 180 top
R66  2kΩ  [R0402]  7.99 7.77 270 top
R67  2kΩ  [R0402]  11.18 11 270 top
R68  10kΩ  [R0402]  10.1 18.79 180 top
RrA  TPL0501-100DCNR  [SOT-23-8_L3.0-W1.7-P0.65-LS2.8-BL]  5.51 7.98 180 top
RrB  TPL0501-100DCNR  [SOT-23-8_L3.0-W1.7-P0.65-LS2.8-BL]  2.11 7.98 180 top
U1  ESP32-C3FH4  [QFN-32_L5.0-W5.0-P0.50-TL-EP3.7]  5.65 13.39 0 top
U5  SSP7615-33DFR  [XDFN-4_L1.0-W1.0-P0.65-BL-EP]  13.59 7.75 0 top
U19  X1311WV-02J-C40D24  [HDR-TH_2P-P1.27-V-M]  10.72 13.64 0 top
U20  X1311WV-02J-C40D24  [HDR-TH_2P-P1.27-V-M#2]  10.73 14.91 180 top
U21  HX PZ1.0-1x2P ZZ  [HDR-TH_2P-P1.00-V-M]  13.37 19.5 180 top
U22  HX PZ1.0-1x2P ZZ  [HDR-TH_2P-P1.00-V-M]  13.37 17.78 180 top
U23  TP4054  [SOT-23-5_L2.9-W1.6-P0.95-LS2.8-BR]  10.46 8.18 0 top
X1  40MHz  [CRYSTAL-SMD_4P-L2.0-W1.6-BL_ECS_ECS-240-8-37]  7.36 19.08 0 top

## Footprints (pads in the part's own frame, mm; a bottom-side part is the same pattern mirrored in y, then rotated)
ANT-SMD_L3.2-W1.6_CA-C01
  rect 1x1.7 smd: 1(-1.35,0) 2(1.35,0)
C0402
  rect 0.381x0.54 smd: 1(-0.508,0) 2(0.508,0)
CRYSTAL-SMD_4P-L2.0-W1.6-BL_ECS_ECS-240-8-37
  rect 0.85x0.75 smd: 1(-0.675,-0.525) 2(0.675,-0.525) 3(0.675,0.525) 4(-0.675,0.525)
HDR-TH_2P-P1.00-V-M
  rect 0.8x0.8 hole 0.5: 1(-0.5,0)
  round 0.8 hole 0.5: 2(0.5,0)
HDR-TH_2P-P1.27-V-M
  rect 1x1 hole 0.75: 1(-0.635,0)
  round 1 hole 0.75: 2(0.635,0)
HDR-TH_2P-P1.27-V-M#2
  round 1 hole 0.75: 1(-0.635,0) 2(0.635,0)
IND-SMD_L1.0-W0.5-2
  rect 0.4x0.55 smd: 1(-0.45,0) 2(0.45,0)
IND-SMD_L1.0-W0.5-2#2
  rect 0.381x0.54 smd: 1(-0.508,0) 2(0.508,0)
IND-SMD_L1.0-W0.6
  rect 0.5x0.648 smd: 1(-0.434,0) 2(0.434,0)
LED0402-RD_RED
  rect 0.635x0.54 smd: 1(-0.559,0) 2(0.559,0)
Pad_e952
  round 1.4 smd far side: 1(0,0)
Pad_e962
  round 1.4 smd far side: 1(0,0)
Pad_e994
  round 1.4 smd far side: 1(0,0)
Pad_e1008
  oval 1.524x2.4 smd far side: 1(0,0)
Pad_e1009
  oval 1.524x2.4 smd far side: 1(0,0)
Pad_e1015
  oval 1.524x2.4 smd far side: 1(0,0)
Pad_e1016
  oval 1.524x2.4 smd far side: 1(0,0)
Pad_e1017
  round 1.524 smd: 1(0,0)
Pad_e1018
  round 1.524 smd: 1(0,0)
Pad_e1019
  round 1.524 smd: 1(0,0)
Pad_e1020
  round 1.524 smd: 1(0,0)
Pad_e2874
  round 1.4 smd far side: 1(0,0)
Pad_e2875
  round 1.4 smd far side: 1(0,0)
Pad_e2905
  round 1.4 smd far side: 1(0,0)
QFN-32_L5.0-W5.0-P0.50-TL-EP3.7
  rect 0.65x0.28 smd: 1(-2.478,1.75) 2(-2.478,1.25) 3(-2.478,0.75) 4(-2.478,0.25) 5(-2.478,-0.25) 6(-2.478,-0.75) 7(-2.478,-1.25) 8(-2.478,-1.75) 17(2.478,-1.75) 18(2.478,-1.25) 19(2.478,-0.75) 20(2.478,-0.25) 21(2.478,0.25) 22(2.478,0.75) 23(2.478,1.25) 24(2.478,1.75)
  rect 0.28x0.65 smd: 9(-1.75,-2.478) 10(-1.25,-2.478) 11(-0.75,-2.478) 12(-0.25,-2.478) 13(0.25,-2.478) 14(0.75,-2.478) 15(1.25,-2.478) 16(1.75,-2.478) 25(1.75,2.478) 26(1.25,2.478) 27(0.75,2.478) 28(0.25,2.478) 29(-0.25,2.478) 30(-0.75,2.478) 31(-1.25,2.478) 32(-1.75,2.478)
  rect 3.8x3.8 smd: 33(0,0)
R0402
  rect 0.381x0.559 smd: 1(-0.508,0) 2(0.508,0)
SC-75-3_L1.6-W0.8-P1.00-LS1.7-BR
  rect 0.585x0.301 smd: 1(0.642,-0.5) 2(0.642,0.5) 3(-0.642,0)
sod-323_l1.8-w1.3-ls2.5-rd
  rect 1x0.75 smd: 1(-1.173,0) 2(1.173,0)
SOT-23-5_L2.9-W1.6-P0.95-LS2.8-BR
  rect 1x0.6 smd: 1(1.1,-0.95) 2(1.1,0) 3(1.1,0.95) 4(-1.1,0.95) 5(-1.1,-0.95)
SOT-23-8_L3.0-W1.7-P0.65-LS2.8-BL
  oval 0.364x1 smd: 1(-0.975,-1.312) 2(-0.325,-1.312) 3(0.325,-1.312) 4(0.975,-1.312) 5(0.975,1.312) 6(0.325,1.312) 7(-0.325,1.312) 8(-0.975,1.312)
XDFN-4_L1.0-W1.0-P0.65-BL-EP
  custom 0.2x0.4 smd: 1(-0.325,-0.475) 2(0.325,-0.475) 3(0.325,0.475) 4(-0.325,0.475)
  rect 0.45x0.45 smd rot 45: 5(0,0)

## Nets
3V3: C28.1 C57.2 C64.2 C65.1 C66.2 C67.1 C68.2 LED11.2 R56.1 R61.1 R62.2 R63.2 RrA.2 RrB.2 U1.2 U1.3 U1.11 U1.17 U1.31 U1.32 U5.1
5V_1: NOREF.1 NOREF#10.1
GND: C28.2 C57.1 C61.1 C62.2 C63.1 C64.1 C65.2 C66.1 C67.2 C68.1 L7.2 NOREF#8.1 NOREF#11.1 R66.1 RrA.3 RrA.8 RrB.3 RrB.8 U1.33 U5.2 U5.5 U19.1 U21.1 U22.1 U23.2 X1.2 X1.4
VDD_SPI: U1.18
VIN_5V: D5.2 NOREF#2.1 Q5.1 R67.2 U19.2 U23.4
BAT: NOREF#4.1 Q5.3 U23.3
CHIP_EN: R56.2 U1.7 U21.2
G01: D6.1 NOREF#13.1 RrA.1
G01-1: NOREF#6.1 NOREF#14.1
G02: NOREF#3.1 RrB.1 U1.9
G02-1: NOREF#9.1 NOREF#12.1
G03-1: NOREF#5.1 NOREF#7.1
GPIO0: U1.4
GPIO1: R68.2 U1.5
GPIO2: R62.1 RrA.6 U1.6
GPIO3: R63.1 RrB.6 U1.8
GPIO5: U1.10
GPIO6: RrA.4 RrB.4 U1.12
GPIO7: RrA.5 RrB.5 U1.13
GPIO8: U1.14
GPIO9/BOOT: R61.2 U1.15 U22.2
GPIO10: D6.2 U1.16
GPIO18/USB_DN: U1.25 U20.2
GPIO19/USB_DP: U1.26 U20.1
U0RXD: U1.27
U0TXD: U1.28
$1N7726: C61.2 L2.2 X1.1
$1N7727: L2.1 U1.30
$1N7730: C62.1 U1.29 X1.3
$1N7731: L6.1 L7.1 U1.1
$1N8200: ANT2.1 L6.2
$2N2933: R66.2 U23.5
$2N3051: LED12.1 U23.1
$2N3155: LED12.2 R67.1
$2N4196: C63.2 D5.1 Q5.2 U5.3 U5.4
$3N7952: LED11.1 R68.1

Pads without a net: ANT2 2; RrA 7; RrB 7; U1 19 20 21 22 23 24

## Via types
v1: diameter 0.5, hole 0.3, Top Layer to Bottom Layer, 67 vias

## Routing (per net, layer and track width the routed paths; a pad name or vN(x,y) marks a point on that pad's centre or on a via; arc(x,y) is an arc through that point)
3V3: length 52.7
  Top Layer w0.2: C66.2 0.72,13.65 R62.2 R56.1 0.72,11.27 R63.2 0.86,11.39 v1(1.05,11.39) 0.74,11.08 C67.1 ; C66.2 1.68,14.68 v1(1.68,15.14) 1.68,15.47 C57.2 ; C66.2 2.16,14.2 2.97,14.2 3.17,14.4 ; 9.63,17.44 9.21,17.86 v1(9.11,17.86) ; RrB.2 2.44,8.7 2.73,8.4 3.55,8.4 3.98,8.83 v1(3.98,10.12) 4.01,10.09 4.4,10.09 4.9,10.59 U1.11 ; C28.1 9.63,17 C65.1 ; v1(11.93,6.44) 12.78,6.44 C64.2 13.26,6.92 U5.1 ; 5.84,9.29 5.84,8.5 v1(5.8,8.46) 7.05,8.46 7.41,8.82 8.4,8.82 8.6,8.62 8.6,8.4 8.87,8.13 v1(9.16,8.13) 9.54,8.13 v1(10.38,8.97) ; 3.17,14.4 U1.2 ; 3.17,14.4 U1.3 ; 4.15,15.87 4.15,16.24 v1(4.15,16.24) ; 4.15,15.87 U1.32 ; 4.15,15.87 U1.31 ; 10.17,11.55 C68.2 9.26,11.58 9.2,11.64 U1.17
  Bottom Layer w0.2: v1(10.38,8.97) 10.1,8.97 9.58,9.49 9.58,10.17 10.23,10.83 v1(10.23,11.52) ; v1(11.93,6.44) 11.93,7.12 10.95,8.1 9.19,8.1 v1(9.16,8.13) ; v1(1.05,11.39) 1.35,11.69 3.49,11.69 3.98,11.2 v1(3.98,10.12) 4.14,10.12 4.37,9.89 4.37,9.64 5.55,8.46 v1(5.8,8.46) ; v1(1.69,15.14) 3.29,15.14 4.15,15.99 v1(4.15,16.24) 4.17,16.26 5.79,16.26 6.63,17.1 6.63,18.41 7.32,19.1 8.9,19.1 v1(9.37,19.57) 9.37,18.12 v1(9.11,17.86)
  vias: v1(0.71,12.67)
5V_1: length 1.8
  Top Layer w0.254: NOREF.1 13.48,3.14 v1(13.48,3.25)
GND:
  vias: v1(0.63,18.11) v1(1.24,18.11) v1(1.24,17.5) v1(1.24,16.89) v1(1.24,16.28) v1(1.81,9.98) v1(1.85,18.11) v1(1.85,16.28) v1(2.47,18.11) v1(2.47,16.28) v1(2.47,15.66) v1(3.33,6.41) v1(3.96,15.06) v1(4.45,17.67) v1(4.45,17.06) v1(4.6,20.12) v1(4.6,19.51) v1(4.6,18.9) v1(4.6,18.28) v1(5.19,9.53) v1(7.01,6.32) v1(7.71,8.32) v1(8.14,17.96) v1(10.08,9.97) v1(11.32,18.68) v1(11.88,8.39) v1(14.34,7.73)
VIN_5V: length 13
  Top Layer w0.2: D5.2 14.27,15.26 12.94,13.93 12.41,13.93 12.12,13.64 U19.2 ; 9.15,9.13 9.82,9.13 10.17,9.47 10.4,9.47 v1(11.03,10.11) 11.18,10.25 11.18,10.49 ; Q5.1 13.04,9.64 v1(13.02,9.64)
  Bottom Layer w0.2: v1(13.02,9.64) 12.32,10.34 11.03,10.34 ; U19.2 11.36,10.67 11.03,10.34 ; 11.03,10.34 11.03,10.11 v1(11.03,10.11)
BAT: length 7.1
  Top Layer w0.2: Q5.3 13.81,11.19 v1(13.33,11.19) ; v1(11.52,9.62) 11.52,9.3 11.35,9.13
  Bottom Layer w0.2: v1(11.52,9.62) 12.03,9.11 13.2,9.11 13.59,9.5 13.59,9.89 13.33,10.15 v1(13.33,11.19) 13.33,12.65 NOREF#4.1
CHIP_EN: length 15
  Top Layer w0.2: U1.7 3.12,12.19 v1(2.44,12.19) R56.2
  Bottom Layer w0.2: U21.2 10.13,16.76 7.41,16.76 5.2,14.55 4.69,14.55 2.44,12.3 v1(2.44,12.19)
G01: length 18.4
  Top Layer w0.2: v1(14.14,14.29) 13.03,13.18 D6.1 ; v1(8.39,9.33) 7.32,9.33 7.29,9.29 6.87,9.29 6.87,9.29 RrA.1
  Bottom Layer w0.2: v1(14.14,14.29) 14.84,13.59 14.84,7.48 14.33,6.97 NOREF#13.1 12.56,6.97 11.06,8.47 9.96,8.47 9.11,9.33 v1(8.39,9.33)
G01-1: length 1.9
  Top Layer w0.127: v1(11.34,3.25) 11.16,3.25 10.04,2.13 NOREF#6.1
G02: length 12.5
  Top Layer w0.2: v1(10.02,6.46) 10.01,6.45 7.74,6.45 v1(6.59,7.6) ; U1.9 3.58,10.59 v1(2.75,10.59)
  Bottom Layer w0.2: v1(6.59,7.6) 5.46,7.6 4.65,6.79 3.89,6.79 3.36,7.32 v1(3.36,9.47) 2.75,10.08 v1(2.75,10.59)
G02-1: length 2.4
  Top Layer w0.127: v1(8.29,3.25) 6.99,1.95 NOREF#9.1
G03-1: length 1.7
  Top Layer w0.254: v1(5.24,3.25) 5.24,2.97 NOREF#7.1
GPIO1: length 11.3
  Top Layer w0.2: v1(2.29,13.66) 2.29,13.59 2.74,13.14 U1.5 ; v1(8.86,18.51) 9.31,18.51 R68.2
  Bottom Layer w0.2: v1(8.86,18.51) 7.16,18.51 6.93,18.28 6.93,16.97 4.81,14.85 4.57,14.85 3.38,13.66 v1(2.29,13.66)
GPIO2: length 12.9
  Top Layer w0.2: v1(0.98,8.03) 1.22,7.79 4.87,7.79 5.19,7.48 RrA.6 ; U1.6 2.7,12.64 2.48,12.87 v1(2.22,12.87) 1.97,13.11 R62.1
  Bottom Layer w0.2: v1(2.22,12.87) 1.82,12.87 0.4,11.45 0.4,8.61 v1(0.98,8.03)
GPIO3: length 7.2
  Top Layer w0.2: U1.8 2.88,11.64 v1(2.25,11.02) 1.99,11.02 R63.1
  Bottom Layer w0.2: v1(2.25,11.02) 1.64,11.02 0.87,10.24 0.87,9.34 1.85,8.36 v1(1.85,6.93)
GPIO6: length 6.9
  Top Layer w0.2: U1.12 5.4,10.52 4.53,9.66 RrA.4 4.53,8.96 3.67,8.1 1.81,8.1 1.13,8.77 RrB.4
GPIO7: length 11.8
  Top Layer w0.2: U1.13 5.9,10.42 6.13,10.19 6.59,10.19 6.6,10.18 6.71,10.18 v1(7.08,9.81) ; RrB.5 1.13,7.14 1.43,7.43 3.25,7.43 3.39,7.29 v1(4.44,7.29) 4.53,7.2 RrA.5
  Bottom Layer w0.2: v1(4.44,7.29) 5.11,7.96 6.01,7.96 6.33,8.28 6.33,8.81 5.91,9.23 5.91,9.75 6.17,10.01 6.88,10.01 v1(7.08,9.81)
GPIO9/BOOT: length 13.7
  Top Layer w0.2: 8.52,11 8.99,10.53 R61.2 ; 8.52,11 8.52,10.55 8.08,10.11 7.67,10.11 7.47,10.31 7.18,10.31 6.91,10.58 6.91,10.9 U1.15 ; 8.52,11 v1(8.42,11.1)
  Bottom Layer w0.2: v1(8.42,11.1) 8.67,11.35 8.67,15.93 9.2,16.46 10.51,16.46 11.83,17.78 U22.2
GPIO10: length 11
  Top Layer w0.2: D6.2 12.35,15.52 v1(12.09,15.78) ; v1(7.77,10.91) 7.41,10.91 U1.16
  Bottom Layer w0.2: v1(12.09,15.78) 11.71,16.16 9.44,16.16 8.97,15.7 8.97,10.94 8.59,10.55 8.26,10.55 7.91,10.91 v1(7.77,10.91)
GPIO18/USB_DN: length 3.7
  Top Layer w0.2: U1.25 7.57,16.04 9.56,16.04 10.2,15.4 10.2,15.02 U20.2
GPIO19/USB_DP: length 5.9
  Top Layer w0.2: U20.1 11.37,15.56 10.48,16.45 7.16,16.45 6.9,16.19 U1.26
$1N7726: length 2.1
  Top Layer w0.2: L2.2 5.22,17.86 5.22,18.35 C61.2 6.66,18.58 X1.1
$1N7727: length 1
  Top Layer w0.2: U1.30 4.9,16.52 L2.1
$1N7730: length 6.6
  Top Layer w0.2: U1.29 5.4,16.19 5.84,16.63 5.84,17.03 v1(5.92,17.11) 6.68,17.11 C62.1
  Bottom Layer w0.2: v1(8.48,19.6) 7.14,19.6 5.92,18.38 v1(5.92,17.11)
$1N7731: length 3.4
  Top Layer w0.2: L7.1 2.58,17.06 L6.1 3.17,16.63 U1.1
$1N8200: length 1.5
  Top Layer w0.2: ANT2.1 3.58,17.98 L6.2
$2N2933: length 1.2
  Top Layer w0.2: 9.15,7.23 9.11,7.26 R66.2
$2N3051: length 4.2
  Top Layer w0.2: LED12.1 12.38,10.39 12.38,7.45 12.15,7.23 11.35,7.23
$2N3155: length 1.1
  Top Layer w0.2: LED12.2 12.14,11.51 R67.1
$2N4196: length 6.5
  Top Layer w0.2: 13.91,8.23 13.75,8.39 13.43,8.39 U5.4 13.11,8.38 C63.2 13.16,8.95 14.13,9.92 Q5.2 14.32,13.13 D5.1
$3N7952: length 0.9
  Top Layer w0.2: LED11.1 R68.1

## Copper pours and planes (outline as drawn; the poured copper is in the pictures)
GND on Top Layer: -2.47,21.55 20.86,21.55 20.86,4.33 -2.47,4.33
GND on Bottom Layer: -4.17,21.17 19.28,21.17 19.28,5.38 -4.17,5.38

Small or netless copper shapes (teardrops, artwork), in the pictures only: 123 on Top Layer, 38 on Bottom Layer

## Text on the board
Bottom Silkscreen Layer: GAVV / HW:2.10_BG | GND | BAT | 5V | 1  2  3
Top Silkscreen Layer: 3 | 1
